# Altium project Modulo RF MK1.PrjPcb (part 2 of 2)

## Sheet SX1262.SchDoc
size A4; SheetNumber: 4; SheetTotal: 5; SPICEModelCacheZNNNHYHD: <root> / <DocumentId>ZNNNHYHD</DocumentId> / <CacheFrame Number="0"> / <Model Name="0603_885012206071_100nf" Kind="CKT"> / <Text>******* / .subckt 0603_885012206071_100nF 1 2 / Rser 1 3 0.025 / Lser 2 4 0.0000000008 / C1 3 4 0.0000001 / Rpar 3 4 5000000000 / .ends 0603_885012206071_100nF</Text> / </Model> / <Model Name="0603_885012206050_470nf" Kind="CKT"> / <Text>******* / .subckt 0603_885012206050_470nF 1 2 / Rser 1 3 0.00930503966198 / Lser 2 4 4.27988831E-10 / C1 3 4 0.00000047 / Rpar 3 4 1100000000 / .ends 0603_885012206050_470nF</Text> / </Model> / <Model Name="0805_150080rs75000" Kind="CKT"> / <Text>****** / .subckt 0805_150080RS75000  1  2 / D1 1 2 SMCW / .MODEL SMCW D / + IS=10.000E-21 / + N=1.6992 / + RS=1.0000E-6 / + IKF=1.2373E-3 / + CJO=1.0000E-12 / + M=.3333 / + VJ=.75 / + BV=5 / + IBV=10.00E-6 / + TT=5.0000E-9 / .ends</Text> / </Model> / <Model Name="0603_7447610139_0.039u" Kind="CKT"> / <Text>******* / .subckt 0603_7447610139_0.039u 1 2 / C1 1 N7 100.5018f / L1 1 N1 37n / L2 N1 N2 2.0340n / L3 N2 N3 972.6366p / L4 N3 N4 657.9738p / L5 N4 N5 1.5334n / L6 N5 N6 8.1575n / R1 2 N1 239.9382m / R2 2 N2 481.8469m / R3 2 N3 430.1578m / R4 2 N4 314.3276m / R5 2 N5 80.2688m / R6 2 N6 58.6487m / R7 2 N7 3.7517 / R8 2 1 10G / R9 2 1 160 / .ends</Text> / </Model> / <Model Name="0603_885012206065_10nf" Kind="CKT"> / <Text>******* / .subckt 0603_885012206065_10nF 1 2 / Rser 1 3 0.05893 / Lser 2 4 0.00000000037916 / C1 3 4 0.00000001 / Rpar 3 4 10000000000 / .ends 0603_885012206065_10nF</Text> / </Model> / <Model Name="0603_885012206069_47nf" Kind="CKT"> / <Text>******* / .subckt 0603_885012206069_47nF 1 2 / Rser 1 3 0.01832 / Lser 2 4 0.0000000002418 / C1 3 4 0.000000047 / Rpar 3 4 10000000000 / .ends 0603_885012206069_47nF</Text> / </Model> / <Model Name="1008_744762147a_47n" Kind="CKT"> / <Text>******* / .subckt 1008_744762147A_47n 1 2 / C1 1 N7 187.1203f / L1 1 N1 46n / L2 N1 N2 1.2911n / L3 N2 N3 1.9110n / L4 N3 N4 1.5623n / L5 N4 N5 740.2101p / L6 N5 N6 68.3322p / R1 2 N1 2.0169 / R2 2 N2 1.5313 / R3 2 N3 1.6598 / R4 2 N4 1.3405 / R5 2 N5 1.209 / R6 2 N6 1.1626 / R7 2 N7 3.6683 / R8 2 1 1000000 / .ends 1008_744762147A_47n</Text> / </Model> / <Model Name="0603_744761115a_15n" Kind="CKT"> / <Text>******* / .subckt 0603_744761115A_15n 1 2 / C1 1 N7 0.105542903228171p / L1 1 N1 14.3n / L2 N1 N2 338.6149p / L3 N2 N3 619.0164p / L4 N3 N4 934.6943p / L5 N4 N5 76.1373p / L6 N5 N6 53.9019p / R1 2 N1 2.435 / R2 2 N2 925.4044m / R3 2 N3 603.5517m / R4 2 N4 600.2547m / R5 2 N5 578.6399m / R6 2 N6 479.7717m / R7 2 N7 1.9331 / R8 2 1 1000000 / .ends 0603_744761115A_15n</Text> / </Model> / <Model Name="0603_885012006048_3.3pf" Kind="CKT"> / <Text>******* / .subckt 0603_885012006048_3.3pF 1 2 / Rser 1 3 0.351777802818 / Lser 2 4 4.93521689E-10 / C1 3 4 0.0000000000033 / Rpar 3 4 10000000000 / .ends 0603_885012006048_3.3pF</Text> / </Model> / <Model Name="0603_7847805220_2.2n" Kind="CKT"> / <Text>******* / .subckt 0603_7847805220_2.2n 1 2 / C1 1 N7 686.0925f / L1 1 N1 2.1n / L2 N1 N2 136.0516p / L3 N2 N3 166.0962p / L4 N3 N4 524.5172p / L5 N4 N5 77.7100p / L6 N5 N6 54.7805p / R1 2 N1 276.0085m / R2 2 N2 184.4143m / R3 2 N3 115.4778m / R4 2 N4 391.2767m / R5 2 N5 342.0058m / R6 2 N6 95.2030m / R7 2 N7 2.0158 / R8 2 1 10g / .ends</Text> / </Model> / <Model Name="0603_744761047a_4.7n" Kind="CKT"> / <Text>******* / .subckt 0603_744761047A_4.7n 1 2 / C1 1 N7 0.160208824188283p / L1 1 N1 4n / L2 N1 N2 133.4552p / L3 N2 N3 339.8837p / L4 N3 N4 550.3992p / L5 N4 N5 78.2267p / L6 N5 N6 55.0949p / R1 2 N1 1.3941 / R2 2 N2 362.6733m / R3 2 N3 365.5944m / R4 2 N4 377.4310m / R5 2 N5 356.9140m / R6 2 N6 101.5009m / R7 2 N7 1.9462 / R8 2 1 1000000 / .ends 0603_744761047A_4.7n</Text> / </Model> / </CacheFrame> / </root>
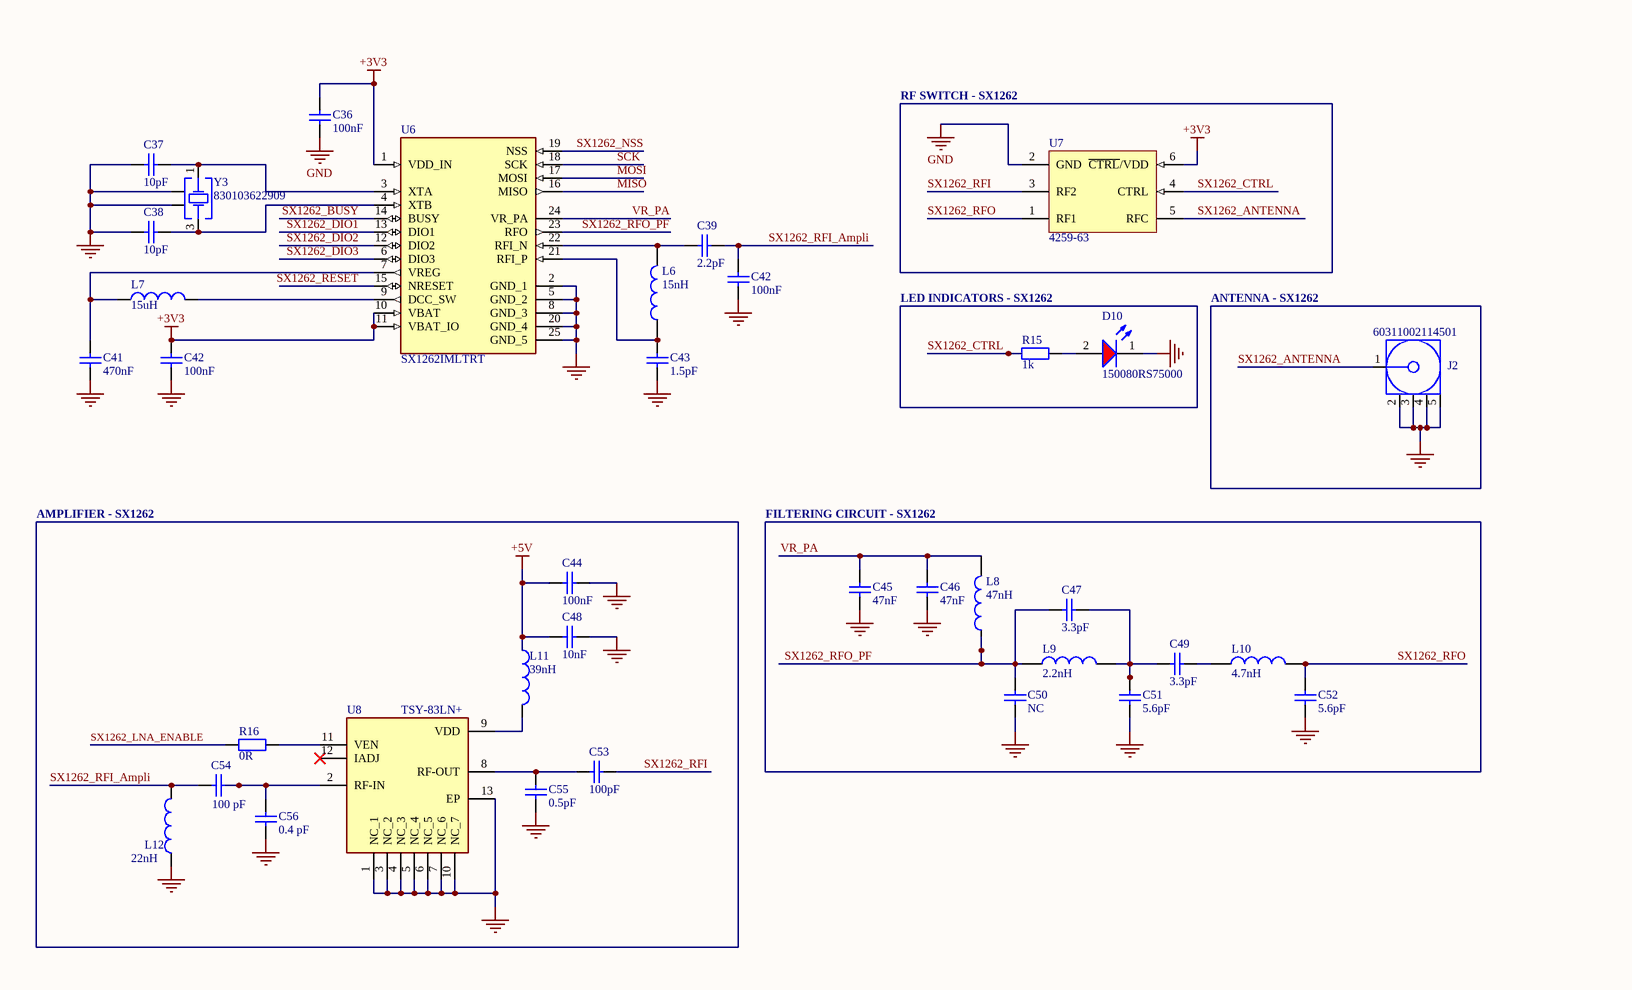
[diagram p3: SX1262.SchDoc, left]

### Parts
(Parts that share a designator on the sheet are numbered #1, #2 ... from top to bottom, then left to right.)
C36  value 100nF  [WCAP-CSGP_0603_L1.6W0.8H0.8_Reflow]  (hidden comment: 885012206071)
C37  value 10pF  [WCAP-CSGP_0603_L1.6W0.8H0.8_Reflow]  (hidden comment: 885012006051)
C38  value 10pF  [WCAP-CSGP_0603_L1.6W0.8H0.8_Reflow]  (hidden comment: 885012006051)
C39  value 2.2pF  [WCAP-CSGP_0603_L1.6W0.8H0.8_Reflow]  (hidden comment: 885012006047)
C41  value 470nF  [WCAP-CSGP_0603_L1.6W0.8H0.8_Reflow]  (hidden comment: 885012206050)
C42#1  value 100nF  [WCAP-CSGP_0603_L1.6W0.8H0.8_Reflow]  (hidden comment: 885012206071)
C42#2  value 100nF  [WCAP-CSGP_0603_L1.6W0.8H0.8_Reflow]  (hidden comment: 885012206071)
C43  value 1.5pF  [WCAP-CSGP_0603_L1.6W0.8H0.8_Reflow]  (hidden comment: 885012006088)
C44  value 100nF  [WCAP-CSGP_0603_L1.6W0.8H0.8_Reflow]  (hidden comment: 885012206071)
C45  value 47nF  [WCAP-CSGP_0603_L1.6W0.8H0.8_Reflow]  (hidden comment: 885012206069)
C46  value 47nF  [WCAP-CSGP_0603_L1.6W0.8H0.8_Reflow]  (hidden comment: 885012206069)
C47  value 3.3pF  [WCAP-CSGP_0603_L1.6W0.8H0.8_Reflow]  (hidden comment: 885012006048)
C48  value 10nF  [WCAP-CSGP_0603_L1.6W0.8H0.8_Reflow]  (hidden comment: 885012206065)
C49  value 3.3pF  [WCAP-CSGP_0603_L1.6W0.8H0.8_Reflow]  (hidden comment: 885012006048)
C50  value NC  [WCAP-CSGP_0603_L1.6W0.8H0.8_Reflow]  (hidden comment: 885012006092)
C51  value 5.6pF  [WCAP-CSGP_0603_L1.6W0.8H0.8_Reflow]  (hidden comment: 885012006092)
C52  value 5.6pF  [WCAP-CSGP_0603_L1.6W0.8H0.8_Reflow]  (hidden comment: 885012006092)
C53  value 100pF  [WCAP-CSGP_0603_L1.6W0.8H0.8_Reflow]  (hidden comment: 885012006057)
C54  value 100 pF  [WCAP-CSGP_0603_L1.6W0.8H0.8_Reflow]  (hidden comment: 885012206071)
C55  value 0.5pF  [WCAP-CSGP_0603_L1.6W0.8H0.8_Reflow]  (hidden comment: 885012006086)
C56  value 0.4 pF  [WCAP-CSGP_0603_L1.6W0.8H0.8_Reflow]  (hidden comment: 885012206071)
D10  150080RS75000  [WL-SMCW_0805_150080xx75000]
J2  60311002114501  [60311002114501]
L6  Inductance: 15nH  [WE-KI_0603]  (hidden comment: 744761115A)
L7  15uH  [WE-TCI_0402]
L8  Inductance: 47nH  [WE-KI_1008]  (hidden comment: 744762147A)
L9  Inductance: 2.2nH  [WE-MCI_0603]  (hidden comment: 7847805220)
L10  Inductance: 4.7nH  [WE-KI_0603]  (hidden comment: 744761047A)
L11  Inductance: 39nH  [WE-RFI_0603]  (hidden comment: 7447610139)
L12  22nH  [WE-KI_0402]
R15  value 1k  [WRIS-RSKS_0603_Reflow]  (hidden comment: 560112116014)
R16  0R  [WRIS-RSKS_0603_Reflow]
U6  SX1262IMLTRT  [SX1262IMLTRT-Footprint-1]
U7  4259-63  [PERE-SC-70-6_M]
U8  TSY-83LN+  [TSY-83LN+-Footprint-1]
Y3  830103622909  [WE-XTAL_CFPX-180]

### Blocks framed on the sheet
RF SWITCH - SX1262: U7
LED INDICATORS - SX1262: D10 R15
ANTENNA - SX1262: J2
AMPLIFIER - SX1262: C44 C48 C53-C56 L11 L12 R16 U8
FILTERING CIRCUIT - SX1262: C45-C47 C49-C52 L8-L10

### Nets
+3V3: C36.2 C42#2.2 U6.1(VDD_IN) U6.10(VBAT) U6.11(VBAT_IO) U7.6(~{CTRL}/VDD)  [project net 3V3_Current-]
+5V: C44.1 C48.1 L11.1  [project net 5V_Current-]
GND: C36.1 C37.1 C38.1 C41.1 C42#1.1 C42#2.1 C43.1 C44.2 C45.1 C46.1 C48.2 C50.1 C51.1 C52.1 C55.1 C56.1 D10.1(K) J2.2(GND) J2.3(GND) J2.4(GND) J2.5(GND) L12.1 U6.2(GND_1) U6.5(GND_2) U6.8(GND_3) U6.20(GND_4) U6.25(GND_5) U7.2(GND) U8.1(NC_1) U8.3(NC_2) U8.4(NC_3) U8.5(NC_4) U8.6(NC_5) U8.7(NC_6) U8.10(NC_7) U8.13(EP) Y3.2(GND&Lid) Y3.4(GND&Lid)
MISO: U6.16(MISO)
MOSI: U6.17(MOSI)
SCK: U6.18(SCK)
SX1262_ANTENNA: J2.1(Signal) U7.5(RFC)
SX1262_BUSY: U6.14(BUSY)
SX1262_CTRL: R15.1 U7.4(CTRL)
SX1262_DIO1: U6.13(DIO1)
SX1262_DIO2: U6.12(DIO2)
SX1262_DIO3: U6.6(DIO3)
SX1262_LNA_ENABLE: R16.2
SX1262_NSS: U6.19(NSS)
SX1262_RESET: U6.15(NRESET)
SX1262_RFI: C53.2 U7.3(RF2)
SX1262_RFI_Ampli: C39.2 C42#1.2 C54.2 L12.2
SX1262_RFO: C52.2 L10.2 U7.1(RF1)
SX1262_RFO_PF: C47.1 C50.2 L8.1 L9.1 U6.23(RFO)
VR_PA: C45.2 C46.2 L8.2 U6.24(VR_PA)
NetC37_2: C37.2 U6.3(XTA) Y3.1(Crystal)
NetC38_2: C38.2 U6.4(XTB) Y3.3(Crystal)
NetC39_1: C39.1 L6.2 U6.22(RFI_N)
NetC41_2: C41.2 L7.1 U6.7(VREG)
NetC43_2: C43.2 L6.1 U6.21(RFI_P)
NetC47_2: C47.2 C49.1 C51.2 L9.2
NetC49_2: C49.2 L10.1
NetC53_1: C53.1 C55.2 U8.8(RF-OUT)
NetC54_1: C54.1 C56.2 U8.2(RF-IN)
NetD10_2: D10.2(A) R15.2
NetL7_2: L7.2 U6.9(DCC_SW)
NetL11_2: L11.2 U8.9(VDD)
NetR16_1: R16.1 U8.11(VEN)

Not connected (* = marked no-connect by the designer): U8 12(IADJ)*

### Library data of the parts
C36 C42#1 C42#2 C44 C54 C56 = CMP-001-00661-1: WCAP-CSGP Multilayer Ceramic Chip Capacitor, General Purpose, size 0603, X7R, 100nF, 25VDC; Manufacturer: Wurth Elektronik; Dissipation Factor: 3.5%; Capacitance Tolerance: +/-10%; Insulation Resistance: 5GOhm; Technical Reference: X7R0603104K025DFCT10000; Rated Voltage (DC): 25V; Packaging: Tape and Reel; Height: 0.8mm; Mount: Surface Mount; Source: WCAP-CSGP.SchLib; Component Type: Standard; Category: Multilayer Ceramic Chip Capacitors; Operating Temperature Min: -55°C; Case/Package: 0603; ComponentLink2Description: Datasheet Link; Width: 0.8mm; ComponentLink1URL: https://www.we-online.com/redexpert/article/885012206071?ad; Length: 1.6mm; Operating Temperature Max: 125°C; Match Code: WCAP-CSGP; ComponentLink2URL: https://www.we-online.com/redexpert/spec/885012206071?ad; Design Item ID: 885012206071; ComponentLink1Description: Website Link; Manufacturer Part Number: 885012206071; Pins: 2; Ceramic Type: X7R
C37 C38 = CMP-001-00167-1: WCAP-CSGP Multilayer Ceramic Chip Capacitor, General Purpose, size 0603, NP0, 10pF, 50VDC; Manufacturer: Wurth Elektronik; Technical Reference: NP00603100J050DFCT10000; Q Factor: 600; Capacitance Tolerance: +/-5%; Rated Voltage (DC): 50V; Insulation Resistance: 10GOhm; Match Code: WCAP-CSGP; Design Item ID: 885012006051; Operating Temperature Min: -55°C; ComponentLink2Description: Datasheet Link; Packaging: Tape and Reel; Category: Multilayer Ceramic Chip Capacitors; ComponentLink2URL: https://www.we-online.com/redexpert/spec/885012006051?ad; Operating Temperature Max: 125°C; Component Type: Standard; Mount: Surface Mount; ComponentLink1URL: https://www.we-online.com/redexpert/article/885012006051?ad; ComponentLink1Description: Website Link; Ceramic Type: NP0; Case/Package: 0603; Height: 0.8mm; Width: 0.8mm; Length: 1.6mm; Source: WCAP-CSGP.SchLib; Manufacturer Part Number: 885012006051; Pins: 2
C39 = CMP-001-00163-1: WCAP-CSGP Multilayer Ceramic Chip Capacitor, General Purpose, size 0603, NP0, 2.2pF, 50VDC; Manufacturer: Wurth Elektronik; Technical Reference: NP006032R2D050DFCT10000; Q Factor: 444; Insulation Resistance: 10GOhm; Rated Voltage (DC): 50V; Capacitance Tolerance: +/-0.5pF; Mount: Surface Mount; Design Item ID: 885012006047; Length: 1.6mm; Ceramic Type: NP0; ComponentLink2URL: https://www.we-online.com/redexpert/spec/885012006047?ad; Operating Temperature Max: 125°C; Pins: 2; Match Code: WCAP-CSGP; ComponentLink2Description: Datasheet Link; ComponentLink1URL: https://www.we-online.com/redexpert/article/885012006047?ad; Case/Package: 0603; Manufacturer Part Number: 885012006047; Operating Temperature Min: -55°C; Category: Multilayer Ceramic Chip Capacitors; Width: 0.8mm; Component Type: Standard; Source: WCAP-CSGP.SchLib; ComponentLink1Description: Website Link; Packaging: Tape and Reel; Height: 0.8mm
C41 = CMP-001-00640-1: WCAP-CSGP Multilayer Ceramic Chip Capacitor, General Purpose, size 0603, X7R, 470nF, 16VDC; Manufacturer: Wurth Elektronik; Insulation Resistance: 1.1GOhm; Dissipation Factor: 5%; Rated Voltage (DC): 16V; Capacitance Tolerance: +/-10%; Technical Reference: X7R0603474K016DFCT10000; Operating Temperature Max: 125°C; Width: 0.8mm; ComponentLink2URL: https://www.we-online.com/redexpert/spec/885012206050?ad; Packaging: Tape and Reel; Mount: Surface Mount; Case/Package: 0603; Operating Temperature Min: -55°C; Manufacturer Part Number: 885012206050; Category: Multilayer Ceramic Chip Capacitors; Component Type: Standard; Ceramic Type: X7R; Design Item ID: 885012206050; Pins: 2; Height: 0.8mm; ComponentLink2Description: Datasheet Link; ComponentLink1URL: https://www.we-online.com/redexpert/article/885012206050?ad; Length: 1.6mm; Match Code: WCAP-CSGP; ComponentLink1Description: Website Link; Source: WCAP-CSGP.SchLib
C43 = CMP-001-00193-1: WCAP-CSGP Multilayer Ceramic Chip Capacitor, General Purpose, size 0603, NP0, 1.5pF, 100VDC; Manufacturer: Wurth Elektronik; Technical Reference: NP006031R5C100DFCT10000; Insulation Resistance: 10GOhm; Rated Voltage (DC): 100V; Capacitance Tolerance: +/-0.25pF; Q Factor: 430; Length: 1.6mm; Ceramic Type: NP0; ComponentLink2URL: https://www.we-online.com/redexpert/spec/885012006088?ad; Source: WCAP-CSGP.SchLib; Match Code: WCAP-CSGP; Operating Temperature Max: 125°C; Width: 0.8mm; Manufacturer Part Number: 885012006088; ComponentLink1URL: https://www.we-online.com/redexpert/article/885012006088?ad; Case/Package: 0603; Packaging: Tape and Reel; Pins: 2; Height: 0.8mm; Component Type: Standard; Mount: Surface Mount; ComponentLink1Description: Website Link; ComponentLink2Description: Datasheet Link; Design Item ID: 885012006088; Operating Temperature Min: -55°C; Category: Multilayer Ceramic Chip Capacitors
C45 C46 = CMP-001-00659-1: WCAP-CSGP Multilayer Ceramic Chip Capacitor, General Purpose, size 0603, X7R, 47nF, 25VDC; Manufacturer: Wurth Elektronik; Dissipation Factor: 3.5%; Insulation Resistance: 10GOhm; Rated Voltage (DC): 25V; Capacitance Tolerance: +/-10%; Technical Reference: X7R0603473K025DFCT10000; Manufacturer Part Number: 885012206069; ComponentLink1Description: Website Link; Packaging: Tape and Reel; ComponentLink2URL: https://www.we-online.com/redexpert/spec/885012206069?ad; Width: 0.8mm; Pins: 2; Operating Temperature Min: -55°C; Category: Multilayer Ceramic Chip Capacitors; Case/Package: 0603; Match Code: WCAP-CSGP; Length: 1.6mm; Ceramic Type: X7R; Operating Temperature Max: 125°C; Mount: Surface Mount; ComponentLink1URL: https://www.we-online.com/redexpert/article/885012206069?ad; Component Type: Standard; ComponentLink2Description: Datasheet Link; Design Item ID: 885012206069; Source: WCAP-CSGP.SchLib; Height: 0.8mm
C47 C49 = CMP-001-00164-1: WCAP-CSGP Multilayer Ceramic Chip Capacitor, General Purpose, size 0603, NP0, 3.3pF, 50VDC; Manufacturer: Wurth Elektronik; Q Factor: 466; Rated Voltage (DC): 50V; Insulation Resistance: 10GOhm; Capacitance Tolerance: +/-0.5pF; Technical Reference: NP006033R3D050DFCT10000; Match Code: WCAP-CSGP; ComponentLink2URL: https://www.we-online.com/redexpert/spec/885012006048?ad; Design Item ID: 885012006048; Mount: Surface Mount; Source: WCAP-CSGP.SchLib; ComponentLink1Description: Website Link; Component Type: Standard; ComponentLink2Description: Datasheet Link; Length: 1.6mm; Manufacturer Part Number: 885012006048; Category: Multilayer Ceramic Chip Capacitors; Ceramic Type: NP0; ComponentLink1URL: https://www.we-online.com/redexpert/article/885012006048?ad; Width: 0.8mm; Packaging: Tape and Reel; Height: 0.8mm; Pins: 2; Operating Temperature Min: -55°C; Case/Package: 0603; Operating Temperature Max: 125°C
C48 = CMP-001-00655-1: WCAP-CSGP Multilayer Ceramic Chip Capacitor, General Purpose, size 0603, X7R, 10nF, 25VDC; Manufacturer: Wurth Elektronik; Dissipation Factor: 3.5%; Technical Reference: X7R0603103K025DFCT10000; Capacitance Tolerance: +/-10%; Insulation Resistance: 10GOhm; Rated Voltage (DC): 25V; ComponentLink1Description: Website Link; Packaging: Tape and Reel; Match Code: WCAP-CSGP; Ceramic Type: X7R; ComponentLink1URL: https://www.we-online.com/redexpert/article/885012206065?ad; ComponentLink2URL: https://www.we-online.com/redexpert/spec/885012206065?ad; Component Type: Standard; Case/Package: 0603; Operating Temperature Min: -55°C; ComponentLink2Description: Datasheet Link; Category: Multilayer Ceramic Chip Capacitors; Pins: 2; Mount: Surface Mount; Height: 0.8mm; Source: WCAP-CSGP.SchLib; Length: 1.6mm; Design Item ID: 885012206065; Operating Temperature Max: 125°C; Width: 0.8mm; Manufacturer Part Number: 885012206065
C50-C52 = CMP-001-00197-1: WCAP-CSGP Multilayer Ceramic Chip Capacitor, General Purpose, size 0603, NP0, 5.6pF, 100VDC; Manufacturer: Wurth Elektronik; Capacitance Tolerance: +/-0.5pF; Insulation Resistance: 10GOhm; Q Factor: 512; Rated Voltage (DC): 100V; Technical Reference: NP006035R6D100DFCT10000; Category: Multilayer Ceramic Chip Capacitors; Height: 0.8mm; Manufacturer Part Number: 885012006092; Length: 1.6mm; Source: WCAP-CSGP.SchLib; Mount: Surface Mount; ComponentLink2URL: https://www.we-online.com/redexpert/spec/885012006092?ad; Design Item ID: 885012006092; Ceramic Type: NP0; Match Code: WCAP-CSGP; Operating Temperature Min: -55°C; Packaging: Tape and Reel; Operating Temperature Max: 125°C; ComponentLink1Description: Website Link; ComponentLink1URL: https://www.we-online.com/redexpert/article/885012006092?ad; Pins: 2; Width: 0.8mm; Case/Package: 0603; ComponentLink2Description: Datasheet Link; Component Type: Standard
C53 = CMP-001-00173-1: WCAP-CSGP Multilayer Ceramic Chip Capacitor, General Purpose, size 0603, NP0, 100pF, 50VDC; Manufacturer: Wurth Elektronik; Technical Reference: NP00603101J050DFCT10000; Insulation Resistance: 10GOhm; Q Factor: 1000; Capacitance Tolerance: +/-5%; Rated Voltage (DC): 50V; Component Type: Standard; Design Item ID: 885012006057; ComponentLink1Description: Website Link; ComponentLink1URL: https://www.we-online.com/redexpert/article/885012006057?ad; Case/Package: 0603; Mount: Surface Mount; Width: 0.8mm; ComponentLink2URL: https://www.we-online.com/redexpert/spec/885012006057?ad; Pins: 2; Height: 0.8mm; ComponentLink2Description: Datasheet Link; Ceramic Type: NP0; Length: 1.6mm; Manufacturer Part Number: 885012006057; Operating Temperature Max: 125°C; Match Code: WCAP-CSGP; Category: Multilayer Ceramic Chip Capacitors; Packaging: Tape and Reel; Source: WCAP-CSGP.SchLib; Operating Temperature Min: -55°C
C55 = CMP-001-00191-1: WCAP-CSGP Multilayer Ceramic Chip Capacitor, General Purpose, size 0603, NP0, 0.5pF, 100VDC; Manufacturer: Wurth Elektronik; Technical Reference: NP00603R50C100DFCT10000; Capacitance Tolerance: +/-0.25pF; Rated Voltage (DC): 100V; Insulation Resistance: 10GOhm; Q Factor: 410; Height: 0.8mm; Packaging: Tape and Reel; ComponentLink2URL: https://www.we-online.com/redexpert/spec/885012006086?ad; Manufacturer Part Number: 885012006086; Operating Temperature Min: -55°C; ComponentLink1Description: Website Link; Match Code: WCAP-CSGP; Component Type: Standard; Category: Multilayer Ceramic Chip Capacitors; Source: WCAP-CSGP.SchLib; Length: 1.6mm; Case/Package: 0603; Mount: Surface Mount; ComponentLink1URL: https://www.we-online.com/redexpert/article/885012006086?ad; Width: 0.8mm; Ceramic Type: NP0; Operating Temperature Max: 125°C; Pins: 2; Design Item ID: 885012006086; ComponentLink2Description: Datasheet Link
D10 = CMP-004-00453-1: WL-SMCW Mono-color Chip LED Waterclear, SMT, size 0805, Red, 2V, 140°; Manufacturer: Wurth Elektronik; Luminous Intensity: 150mcd; Peak Wavelength: 630nm; Chip Technology: AlInGaP; Dominant Wavelength: 625nm; ComponentLink2URL: https://www.we-online.com/redexpert/spec/150080RS75000?ad; Case/Package: 0805; Emitting Color: Red; Operating Temperature Max: 85°C; Match Code: WL-SMCW; Length: 2mm; ComponentLink1URL: https://www.we-online.com/redexpert/article/150080RS75000?ad; Mount: Surface Mount; Pins: 2; Manufacturer Part Number: 150080RS75000; Width: 1.25mm; Source: WL-SMCW.SchLib; ComponentLink1Description: Website Link; Component Type: Standard; Design Item ID: 150080RS75000; ComponentLink2Description: Datasheet Link; Height: 0.7mm; Operating Temperature Min: -40°C; Forward Voltage: 2V; Category: Signal LEDs; Packaging: Tape and Reel; Viewing Angle: 140°
J2 = CMP-03913-97004421-2: 60311002114501 Rf Coax Conn, Sma R/A Jack, 50 Ohm, Pcb Rohs Compliant: Yes; Insulation Resistance: 5GΩ; Insertion Loss (dB): 0.14dB; Impedance: 50Ω; Insulation Material: PTFE; Orientation: Right Angle; Min Operating Temperature: -65°C; Max Operating Temperature: 165°C; NexarPartId: 97004421; Connector Type: SMA
L6 = CMP-006-00432-1: WE-KI SMT Wire Wound Ceramic Inductor, size 0603, 15nH, 0.7A, 0.17O; Manufacturer: Wurth Elektronik; Inductance Tolerance: +/-5%; Q Factor: 35; Self Resonant Frequency: 4GHz; ComponentLink1URL: https://www.we-online.com/redexpert/article/744761115A?ad; Width: 1.05mm; Length: 1.6mm; Operating Temperature Min: -40°C; Match Code: WE-KI; Height: 1.05mm; Manufacturer Part Number: 744761115A; Mount: Surface Mount; ComponentLink1Description: Website Link; Packaging: Tape and Reel; Component Type: Standard; Case/Package: 0603; Source: WE-KI.SchLib; Category: RF Inductors; Design Item ID: 744761115A; Rated Current: 0.7A; DC Resistance Max: 0.17O; Operating Temperature Max: 125°C; Pins: 2; ComponentLink2Description: Datasheet Link; ComponentLink2URL: https://www.we-online.com/redexpert/spec/744761115A?ad
L7 = CMP-03913-14415885-1: 744901115 Fixed Ind 15NH 130MA 1.8 Ohm SMD; Tolerance: 2%; Core Material: Alumina; DC Resistance (DCR): 910mΩ; Test Frequency: 500MHz; Self Resonant Frequency: 3.3GHz; Shielding: Unshielded; Q Factor: 13; Case/Package: 0402; Mount: Surface Mount; Inductance Tolerance: 2%; RoHS: Compliant; Composition: Thin Film; Number of Pins: 2; Inductance: 15nH; Packaging: Cut Tape (CT); Height - Seated (Max): 406.4µm; Width: 500µm; Termination: SMD/SMT; Min Operating Temperature: -40°C; NexarPartId: 14415885; Current Rating: 130mA; Height: 320µm; Max DC Current: 130mA; Case Code (Imperial): 0402; Case Code (Metric): 1005; Weight: 652.039032µg; Max Operating Temperature: 125°C; Length: 1mm; REACH SVHC: Unknown
L8 = CMP-006-00525-1: WE-KI SMT Wire Wound Ceramic Inductor, size 1008, 47nH, 1A, 0.1O; Manufacturer: Wurth Elektronik; Inductance Tolerance: +/-5%; Q Factor: 60; Self Resonant Frequency: 1.5GHz; Rated Current: 1A; Operating Temperature Min: -40°C; ComponentLink1URL: https://www.we-online.com/redexpert/article/744762147A?ad; Packaging: Tape and Reel; Mount: Surface Mount; Width: 2mm; Component Type: Standard; Design Item ID: 744762147A; ComponentLink1Description: Website Link; DC Resistance Max: 0.1O; ComponentLink2Description: Datasheet Link; ComponentLink2URL: https://www.we-online.com/redexpert/spec/744762147A?ad; Category: RF Inductors; Pins: 2; Match Code: WE-KI; Case/Package: 1008; Manufacturer Part Number: 744762147A; Source: WE-KI.SchLib; Height: 1.6mm; Operating Temperature Max: 125°C; Length: 2.5mm
L9 = CMP-006-00722-1: WE-MCI Multilayer Ceramic SMT Inductor, size 0603, 2.2nH, 950mA, 0.1Ohm; Manufacturer: Wurth Elektronik; Inductance Tolerance: +/-0.3; Self Resonant Frequency: 6GHz; Q Factor: 8; ComponentLink1URL: https://www.we-online.com/redexpert/article/7847805220?ad; Automotive: Yes; ComponentLink2Description: Datasheet Link; Height: 0.8mm; Source: WE-MCI.SchLib; Operating Temperature Max: 125°C; Manufacturer Part Number: 7847805220; ComponentLink1Description: Website Link; Design Item ID: 7847805220; Pins: 2; Component Type: Standard; Packaging: Tape and Reel; Case/Package: 0603; Match Code: WE-MCI; DC Resistance Max: 0.1Ohm; ComponentLink2URL: https://www.we-online.com/redexpert/spec/7847805220?ad; Operating Temperature Min: -55°C; Mount: Surface Mount; Rated Current: 950mA; Category: RF Inductors; Width: 0.8mm; Length: 1.6mm
L10 = CMP-006-00407-1: WE-KI SMT Wire Wound Ceramic Inductor, size 0603, 4.7nH, 0.7A, 0.13O; Manufacturer: Wurth Elektronik; Inductance Tolerance: +/-0.2nH; Self Resonant Frequency: 5.8GHz; Q Factor: 20; Component Type: Standard; Rated Current: 0.7A; DC Resistance Max: 0.13O; ComponentLink1Description: Website Link; Packaging: Tape and Reel; Design Item ID: 744761047A; Width: 1.05mm; Length: 1.6mm; Operating Temperature Max: 125°C; Height: 1.05mm; Case/Package: 0603; ComponentLink2URL: https://www.we-online.com/redexpert/spec/744761047A?ad; Category: RF Inductors; Match Code: WE-KI; ComponentLink2Description: Datasheet Link; ComponentLink1URL: https://www.we-online.com/redexpert/article/744761047A?ad; Operating Temperature Min: -40°C; Source: WE-KI.SchLib; Manufacturer Part Number: 744761047A; Mount: Surface Mount; Pins: 2
L11 = CMP-006-00269-1: WE-RFI Ferrite SMT Inductor, size 0603, 39nH, 1170mA, 2320MHz; Manufacturer: Wurth Elektronik; DC Resistance Max: 42mOhm; Q Factor: 12; Inductance Tolerance: +/-5%; Impedance Max: 160Ohm; Self Resonant Frequency: 2.32GHz; Impedance @100MHz: 20Ohm; Packaging: Tape and Reel; Case/Package: 0603; ComponentLink2Description: Datasheet Link; Source: WE-RFI.SchLib; Mount: Surface Mount; Manufacturer Part Number: 7447610139; Pins: 2; Category: RF Inductors; Length: 1.65mm; Operating Temperature Max: 85°C; Design Item ID: 7447610139; Width: 1.1mm; ComponentLink1Description: Website Link; Match Code: WE-RFI; Height: 0.9mm; Impedance Max Test Condition: 2320MHz; Rated Current: 1170mA; Operating Temperature Min: -40°C; ComponentLink1URL: https://www.we-online.com/redexpert/article/7447610139?ad; ComponentLink2URL: https://www.we-online.com/redexpert/spec/7447610139?ad; Component Type: Standard
L12 = CMP-03913-11914106-1: 744765122A WE-KI SMT Wire Wound Ceramic Inductor; Series Resistance: 300mΩ; Self Resonant Frequency: 2.8GHz; Tolerance: 5%; Max DC Current: 400mA; Shielding: Unshielded; Q Factor: 25; Test Frequency: 250MHz; Material: Ceramic; Mount: Surface Mount; Ambient Temperature Range Low: -40°C; Width: 550µm; Height - Seated (Max): 609.6µm; Inductance Tolerance: 5%; Termination: SMD/SMT; Resistance: 300mΩ; Number of Pins: 2; Weight: 20mg; Packaging: Cut Tape (CT); Composition: Ceramic, Wirewound; Height: 500µm; Min Operating Temperature: -40°C; Depth: 550µm; Inductance: 22nH; Length: 1mm; DC Resistance (DCR): 300mΩ; Case Code (Metric): 1005; REACH SVHC: Unknown; Max Operating Temperature: 125°C; Case/Package: 0402; Current Rating: 400mA; Case Code (Imperial): 0402; NexarPartId: 11914106; Frequency: 250MHz; Core Material: Ceramic; RoHS: Compliant; Ambient Temperature Range High: 110°C
R15 = CMP-009-00337-1: WRIS-RSKS Thick Film Resistor, size 0603, 1000Ohm, 100mW; Manufacturer: Wurth Elektronik; Resistance Tolerance: +/-1%; Limiting Element Voltage: 75V; Temperature Coefficient of Resistance Min: -100ppm/°C; Temperature Coefficient of Resistance Max: 100ppm/°C; Mount: Surface Mount; Rated Power: 100mW; Packaging: Tape and Reel; Case/Package: 0603; ComponentLink1URL: https://www.we-online.com/redexpert/article/560112116014?ad; Height: 0.45mm; Manufacturer Part Number: 560112116014; ComponentLink1Description: Website Link; ComponentLink2URL: https://www.we-online.com/redexpert/spec/560112116014?ad; Source: WRIS-RSKS.SchLib; Operating Temperature Min: -55°C; Width: 0.8mm; Match Code: WRIS-RSKS; Design Item ID: 560112116014; ComponentLink2Description: Datasheet Link; Category: Thick Film Resistors; Operating Temperature Max: 155°C; Component Type: Standard; Length: 1.6mm; Pins: 2
R16 = CMP-009-00324-1: WRIS-RSKS Thick Film Resistor, size 0603, 100mW; Manufacturer: Wurth Elektronik; Manufacturer Part Number: 560112116001; Height: 0.45mm; Case/Package: 0603; ComponentLink1Description: Website Link; Operating Temperature Min: -55°C; Mount: Surface Mount; ComponentLink1URL: https://www.we-online.com/redexpert/article/560112116001?ad; ComponentLink2URL: https://www.we-online.com/redexpert/spec/560112116001?ad; Packaging: Tape and Reel; Width: 0.8mm; Operating Temperature Max: 155°C; Source: WRIS-RSKS.SchLib; Category: Thick Film Resistors; Component Type: Standard; Rated Power: 100mW; ComponentLink2Description: Datasheet Link; Length: 1.6mm; Design Item ID: 560112116001; Pins: 2; Match Code: WRIS-RSKS
U6 = CMP-00025-00003-2: SX1262 Series 3.7 V 22 dBm 960 MHz 300 kbps Long Range RF Transceiver - QFN - 24; Frequency: 960MHz; Min Operating Temperature: -40°C; Max Operating Temperature: 85°C; RoHS Compliant: Yes
U7 = CMP-2000-05298-1: IC RF Switch SPDT, 50 Ohm, 6-Pin SC70, RoHS, Tape and Reel; Manufacturer: Peregrine Semiconductor; P1dB: 29dBm(typ)IP1dB; Topology: Reflective; Frequency - Upper: 3GHz; Insertion Loss @ Frequency: 0.5dB@2GHz; IIP3: 55dBm(typ); Voltage - Supply: 1.8V~3.3V; Other Names: 1046-1011-24259-63-ND425963PE4259PE4259SCBC-ZPE4259SCBC-Z-ND; Isolation @ Frequency: 20dB@2GHz(typ); Frequency - Lower: 10MHz; Online Catalog: PE4259; Impedance: 50Ohm; RF Type: GeneralPurpose; Series: UltraCMOS; Manufacturer URL: http://www.psemi.com/; Package Description: 6-Pin Small Outline Transistor, Body 2.05 x 1.25 mm, Pitch 0.65 mm; Family: RFSwitches; Packaging: Tape&Reel(TR); Features: Single/DualLineControl; Package / Case: 6-TSSOP,SC-88,SOT-363; Operating Temperature: -40degC~85degC; Circuit: SPDT; Supplier Device Package: SC-70-6; Standard Package: 3,000; Datasheet URL: https://datasheet.ciiva.com/15100/getdatasheetpartid-685660-15100501.pdf; Category: RF/IFandRFID; Datasheet Version: Jan-11; Package Reference: SC-70-6
U8 = CMP-014-00006-1: 0.4-8GHZ Mmic Amplifier
Y3 = CMP-003-00251-1: WE-XTAL Quartz Crystal, SMT, CFPX-180, 32MHz, +/-10ppm; Manufacturer: Wurth Elektronik; Load Capacitance: 9pF; Frequency Stability: +/-15ppm; Length: 3.4mm; ComponentLink2URL: https://www.we-online.com/redexpert/spec/830103622909?ad; Operating Temperature Max: 85°C; Design Item ID: 830103622909; Category: Crystals; Operating Temperature Min: -40°C; Packaging: Tape and Reel; Case/Package: CFPX-180; Manufacturer Part Number: 830103622909; Pins: 4; Width: 2.7mm; Source: WE-XTAL.SchLib; Frequency: 32MHz; Match Code: WE-XTAL; ComponentLink1URL: https://www.we-online.com/redexpert/article/830103622909?ad; Component Type: Standard; ComponentLink2Description: Datasheet Link; Height: 0.8mm; Mount: Surface Mount; Frequency Tolerance: +/-10ppm; ComponentLink1Description: Website Link

## Sheet Current and Voltage Measurement.SchDoc
size A4; SheetNumber: 5; SheetTotal: 5; SPICEModelCacheEZCUKSDU: <root> / <DocumentId>EZCUKSDU</DocumentId> / <CacheFrame Number="0"> / <Model Name="0603_885012206062_3.3nf" Kind="CKT"> / <Text>******* / .subckt 0603_885012206062_3.3nF 1 2 / Rser 1 3 0.09865 / Lser 2 4 0.0000000003316 / C1 3 4 0.0000000033 / Rpar 3 4 10000000000 / .ends 0603_885012206062_3.3nF</Text> / </Model> / </CacheFrame> / </root>
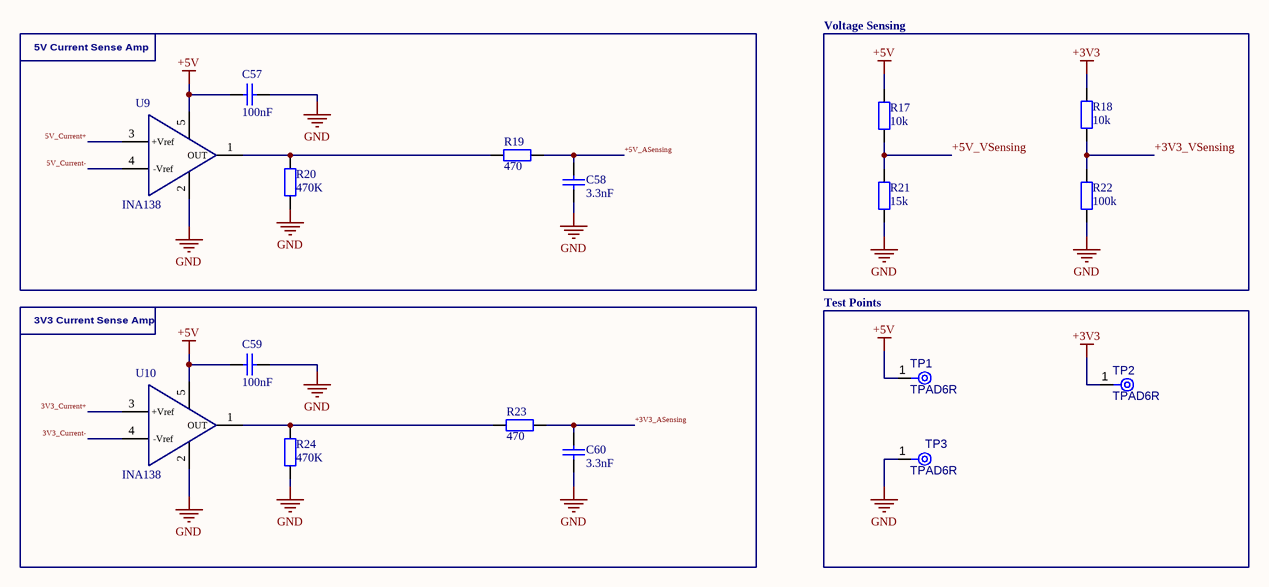
[diagram p4: Current and Voltage Measurement.SchDoc]

### Parts
C57  value 100nF  [WCAP-CSGP_0603_L1.6W0.8H0.8_Reflow]  (hidden comment: 885012206071)
C58  value 3.3nF  [WCAP-CSGP_0603_L1.6W0.8H0.8_Reflow]  (hidden comment: 885012206062)
C59  value 100nF  [WCAP-CSGP_0603_L1.6W0.8H0.8_Reflow]  (hidden comment: 885012206071)
C60  value 3.3nF  [WCAP-CSGP_0603_L1.6W0.8H0.8_Reflow]  (hidden comment: 885012206062)
R17  value 10k  [WRIS-RSKS_0603_Reflow]  (hidden comment: 560112116005)
R18  value 10k  [WRIS-RSKS_0603_Reflow]  (hidden comment: 560112116005)
R19  value 470  [WRIS-RSKS_0603_Reflow]  (hidden comment: 560112116067)
R20  value 470K  [WRIS-RSKS_0603_Reflow]  (hidden comment: 560112116019)
R21  value 15k  [WRIS-RSKS_0603_Reflow]  (hidden comment: 560112116035)
R22  value 100k  [WRIS-RSKS_0603_Reflow]  (hidden comment: 560112116004)
R23  value 470  [WRIS-RSKS_0603_Reflow]  (hidden comment: 560112116067)
R24  value 470K  [WRIS-RSKS_0603_Reflow]  (hidden comment: 560112116019)
TP1  TPAD6R  [TP06R]  (no BOM)
TP2  TPAD6R  [TP06R]  (no BOM)
TP3  TPAD6R  [TP06R]  (no BOM)
U9  INA138  [INA138-Footprint-1]
U10  INA138  [INA138-Footprint-1]

### Blocks framed on the sheet
5V Current Sense Amp: C57 C58 R19 R20 U9
Voltage Sensing: R17 R18 R21 R22
3V3 Current Sense Amp: C59 C60 R23 R24 U10
Test Points: TP1-TP3

### Nets
3V3_Current-: R18.2 TP2.1(TP) U10.4(-Vref)  [also labelled +3V3]
5V_Current-: C57.2 C59.2 R17.2 TP1.1(TP) U9.4(-Vref) U9.5(V+) U10.5(V+)  [also labelled +5V]
GND: C57.1 C58.1 C59.1 C60.1 R20.1 R21.1 R22.1 R24.1 TP3.1(TP) U9.2(GND) U10.2(GND)
3V3_Current+: U10.3(+Vref)
5V_Current+: U9.3(+Vref)
+3V3_ASensing: C60.2 R23.1
+3V3_VSensing: R18.1 R22.2
+5V_ASensing: C58.2 R19.1
+5V_VSensing: R17.1 R21.2
NetR19_2: R19.2 R20.2 U9.1(OUT)
NetR23_2: R23.2 R24.2 U10.1(OUT)

### Library data of the parts
C57 C59 = CMP-001-00661-1: as C36 on sheet SX1262; Packaging: Tape and Reel; Height: 0.8mm; Mount: Surface Mount; Source: WCAP-CSGP.SchLib; Component Type: Standard; Category: Multilayer Ceramic Chip Capacitors; Operating Temperature Min: -55°C; Case/Package: 0603; ComponentLink2Description: Datasheet Link; Width: 0.8mm; ComponentLink1URL: https://www.we-online.com/redexpert/article/885012206071?ad; Length: 1.6mm; Operating Temperature Max: 125°C; Match Code: WCAP-CSGP; ComponentLink2URL: https://www.we-online.com/redexpert/spec/885012206071?ad; Design Item ID: 885012206071; ComponentLink1Description: Website Link; Manufacturer Part Number: 885012206071; Pins: 2; Ceramic Type: X7R
C58 C60 = CMP-001-00652-1: WCAP-CSGP Multilayer Ceramic Chip Capacitor, General Purpose, size 0603, X7R, 3.3nF, 25VDC; Manufacturer: Wurth Elektronik; Capacitance Tolerance: +/-10%; Technical Reference: X7R0603332K025DFCT10000; Dissipation Factor: 3.5%; Rated Voltage (DC): 25V; Insulation Resistance: 10GOhm; ComponentLink2Description: Datasheet Link; Source: WCAP-CSGP.SchLib; Pins: 2; Operating Temperature Min: -55°C; Length: 1.6mm; ComponentLink2URL: https://www.we-online.com/redexpert/spec/885012206062?ad; Ceramic Type: X7R; Manufacturer Part Number: 885012206062; ComponentLink1URL: https://www.we-online.com/redexpert/article/885012206062?ad; ComponentLink1Description: Website Link; Mount: Surface Mount; Case/Package: 0603; Packaging: Tape and Reel; Component Type: Standard; Height: 0.8mm; Operating Temperature Max: 125°C; Width: 0.8mm; Match Code: WCAP-CSGP; Category: Multilayer Ceramic Chip Capacitors; Design Item ID: 885012206062
R17 R18 = CMP-009-00328-1: WRIS-RSKS Thick Film Resistor, size 0603, 10000Ohm, 100mW; Manufacturer: Wurth Elektronik; Limiting Element Voltage: 75V; Temperature Coefficient of Resistance Max: 100ppm/°C; Resistance Tolerance: +/-1%; Temperature Coefficient of Resistance Min: -100ppm/°C; ComponentLink1Description: Website Link; Case/Package: 0603; Pins: 2; Match Code: WRIS-RSKS; Operating Temperature Max: 155°C; Width: 0.8mm; Design Item ID: 560112116005; Length: 1.6mm; ComponentLink2Description: Datasheet Link; ComponentLink2URL: https://www.we-online.com/redexpert/spec/560112116005?ad; Packaging: Tape and Reel; Source: WRIS-RSKS.SchLib; Height: 0.45mm; Manufacturer Part Number: 560112116005; Component Type: Standard; Mount: Surface Mount; Operating Temperature Min: -55°C; Rated Power: 100mW; ComponentLink1URL: https://www.we-online.com/redexpert/article/560112116005?ad; Category: Thick Film Resistors
R19 R23 = CMP-009-00390-1: WRIS-RSKS Thick Film Resistor, size 0603, 470Ohm, 100mW; Manufacturer: Wurth Elektronik; Limiting Element Voltage: 75V; Temperature Coefficient of Resistance Max: 100ppm/°C; Resistance Tolerance: +/-1%; Temperature Coefficient of Resistance Min: -100ppm/°C; Rated Power: 100mW; Height: 0.45mm; ComponentLink2Description: Datasheet Link; Component Type: Standard; ComponentLink1URL: https://www.we-online.com/redexpert/article/560112116067?ad; ComponentLink1Description: Website Link; Operating Temperature Min: -55°C; Match Code: WRIS-RSKS; Mount: Surface Mount; Case/Package: 0603; Source: WRIS-RSKS.SchLib; Length: 1.6mm; Category: Thick Film Resistors; Operating Temperature Max: 155°C; Pins: 2; Packaging: Tape and Reel; Manufacturer Part Number: 560112116067; ComponentLink2URL: https://www.we-online.com/redexpert/spec/560112116067?ad; Width: 0.8mm; Design Item ID: 560112116067
R20 R24 = CMP-009-00342-1: WRIS-RSKS Thick Film Resistor, size 0603, 470000Ohm, 100mW; Manufacturer: Wurth Elektronik; Temperature Coefficient of Resistance Min: -100ppm/°C; Resistance Tolerance: +/-1%; Limiting Element Voltage: 75V; Temperature Coefficient of Resistance Max: 100ppm/°C; Component Type: Standard; ComponentLink2URL: https://www.we-online.com/redexpert/spec/560112116019?ad; ComponentLink1Description: Website Link; Height: 0.45mm; Source: WRIS-RSKS.SchLib; ComponentLink1URL: https://www.we-online.com/redexpert/article/560112116019?ad; Category: Thick Film Resistors; Mount: Surface Mount; Operating Temperature Min: -55°C; Rated Power: 100mW; Pins: 2; Packaging: Tape and Reel; Match Code: WRIS-RSKS; Width: 0.8mm; ComponentLink2Description: Datasheet Link; Design Item ID: 560112116019; Operating Temperature Max: 155°C; Manufacturer Part Number: 560112116019; Length: 1.6mm; Case/Package: 0603
R21 = CMP-009-00358-1: WRIS-RSKS Thick Film Resistor, size 0603, 15000Ohm, 100mW; Manufacturer: Wurth Elektronik; Limiting Element Voltage: 75V; Temperature Coefficient of Resistance Min: -100ppm/°C; Resistance Tolerance: +/-1%; Temperature Coefficient of Resistance Max: 100ppm/°C; Match Code: WRIS-RSKS; Design Item ID: 560112116035; Case/Package: 0603; ComponentLink2URL: https://www.we-online.com/redexpert/spec/560112116035?ad; Category: Thick Film Resistors; Source: WRIS-RSKS.SchLib; ComponentLink2Description: Datasheet Link; Pins: 2; ComponentLink1Description: Website Link; Operating Temperature Max: 155°C; Height: 0.45mm; Length: 1.6mm; Component Type: Standard; Packaging: Tape and Reel; Manufacturer Part Number: 560112116035; Width: 0.8mm; Rated Power: 100mW; Mount: Surface Mount; ComponentLink1URL: https://www.we-online.com/redexpert/article/560112116035?ad; Operating Temperature Min: -55°C
R22 = CMP-009-00327-1: WRIS-RSKS Thick Film Resistor, size 0603, 100000Ohm, 100mW; Manufacturer: Wurth Elektronik; Temperature Coefficient of Resistance Min: -100ppm/°C; Resistance Tolerance: +/-1%; Limiting Element Voltage: 75V; Temperature Coefficient of Resistance Max: 100ppm/°C; Height: 0.45mm; ComponentLink1URL: https://www.we-online.com/redexpert/article/560112116004?ad; Packaging: Tape and Reel; Match Code: WRIS-RSKS; Operating Temperature Max: 155°C; ComponentLink2Description: Datasheet Link; ComponentLink1Description: Website Link; Category: Thick Film Resistors; Operating Temperature Min: -55°C; Length: 1.6mm; Source: WRIS-RSKS.SchLib; Rated Power: 100mW; Mount: Surface Mount; Manufacturer Part Number: 560112116004; ComponentLink2URL: https://www.we-online.com/redexpert/spec/560112116004?ad; Component Type: Standard; Width: 0.8mm; Case/Package: 0603; Pins: 2; Design Item ID: 560112116004
TP1-TP3 = CMP-00028-00002-2: 0.6mm round; Pins: 1
U9 U10 = CMP-014-00004-3: Shunt Current Measure Amplifier; Manufacturer: Texas Instruments; Manufacturer Part Number: INA138NA/3K
  U9: ClassName: 5V OPAMP
  U10: ClassName: 3V3 OPAMP

## Nets that join several sheets
3V3_Current-: MCU (14 pins), Connectors (D4.5 P5.4 R5.2 R6.2), SX1280 MID VELOCITY (5 pins), SX1262 (6 pins), Current and Voltage Measurement (R18.2 TP2.1 U10.4)
5V_Current-: MCU (C13.1 C15.1 Q1.3 Q2.3), Connectors (R7.2 R8.2), SX1280 MID VELOCITY (14 pins), SX1262 (C44.1 C48.1 L11.1), Current and Voltage Measurement (7 pins)
GND: MCU (27 pins), Connectors (12 pins), SX1280 MID VELOCITY (43 pins), SX1262 (38 pins), Current and Voltage Measurement (11 pins)
3V3_Current+: Connectors (6 pins), Current and Voltage Measurement (U10.3)
5V_Current+: Connectors (6 pins), Current and Voltage Measurement (U9.3)
CAN1_N: MCU (Q1.6 R2.1), Connectors (D2.4)
CAN1_P: MCU (Q1.7 R2.2), Connectors (D2.6)
CAN2_N: MCU (Q2.6 R4.1), Connectors (D3.4)
CAN2_P: MCU (Q2.7 R4.2), Connectors (D3.6)
MISO: MCU (U1.14), SX1280 MID VELOCITY (U2.16), SX1262 (U6.16)
MOSI: MCU (U1.15), SX1280 MID VELOCITY (U2.17), SX1262 (U6.17)
SCK: MCU (U1.13), SX1280 MID VELOCITY (U2.18), SX1262 (U6.18)
SWCLK: MCU (U1.43), Connectors (D4.3)
SWDIO: MCU (U1.42), Connectors (D4.1)
SX1262_BUSY: MCU (U1.9), SX1262 (U6.14)
SX1262_DIO1: MCU (U1.4), SX1262 (U6.13)
SX1262_DIO2: MCU (U1.3), SX1262 (U6.12)
SX1262_DIO3: MCU (U1.2), SX1262 (U6.6)
SX1262_LNA_ENABLE: MCU (U1.11), SX1262 (R16.2)
SX1262_NSS: MCU (U1.10), SX1262 (U6.19)
SX1262_RESET: MCU (U1.8), SX1262 (U6.15)
SX1280_M_BUSY: MCU (U1.29), SX1280 MID VELOCITY (U2.7)
SX1280_M_DIO1: MCU (U1.30), SX1280 MID VELOCITY (U2.8)
SX1280_M_DIO2: MCU (U1.39), SX1280 MID VELOCITY (U2.9)
SX1280_M_DIO3: MCU (U1.40), SX1280 MID VELOCITY (U2.10)
SX1280_M_LNA_ENABLE: MCU (U1.18), SX1280 MID VELOCITY (U5.5)
SX1280_M_NRESET: MCU (U1.16), SX1280 MID VELOCITY (U2.3)
SX1280_M_NSS: MCU (U1.17), SX1280 MID VELOCITY (U2.19)
UART_RX: MCU (U1.45), Connectors (P10.2)
UART_TX: MCU (U1.46), Connectors (P10.1)